# EasyEDA Pro project drive.epro, schematic Schematic1
Board Name: Board1; Create Date: 2024-12-01; Page Name: P1; Project Name: 2025完全模型组硬件_Bone; Schematic Name: Schematic1; Update Date: 2024-12-14; Company: 嘉立创EDA; Page Size: A1; Version: V1.0
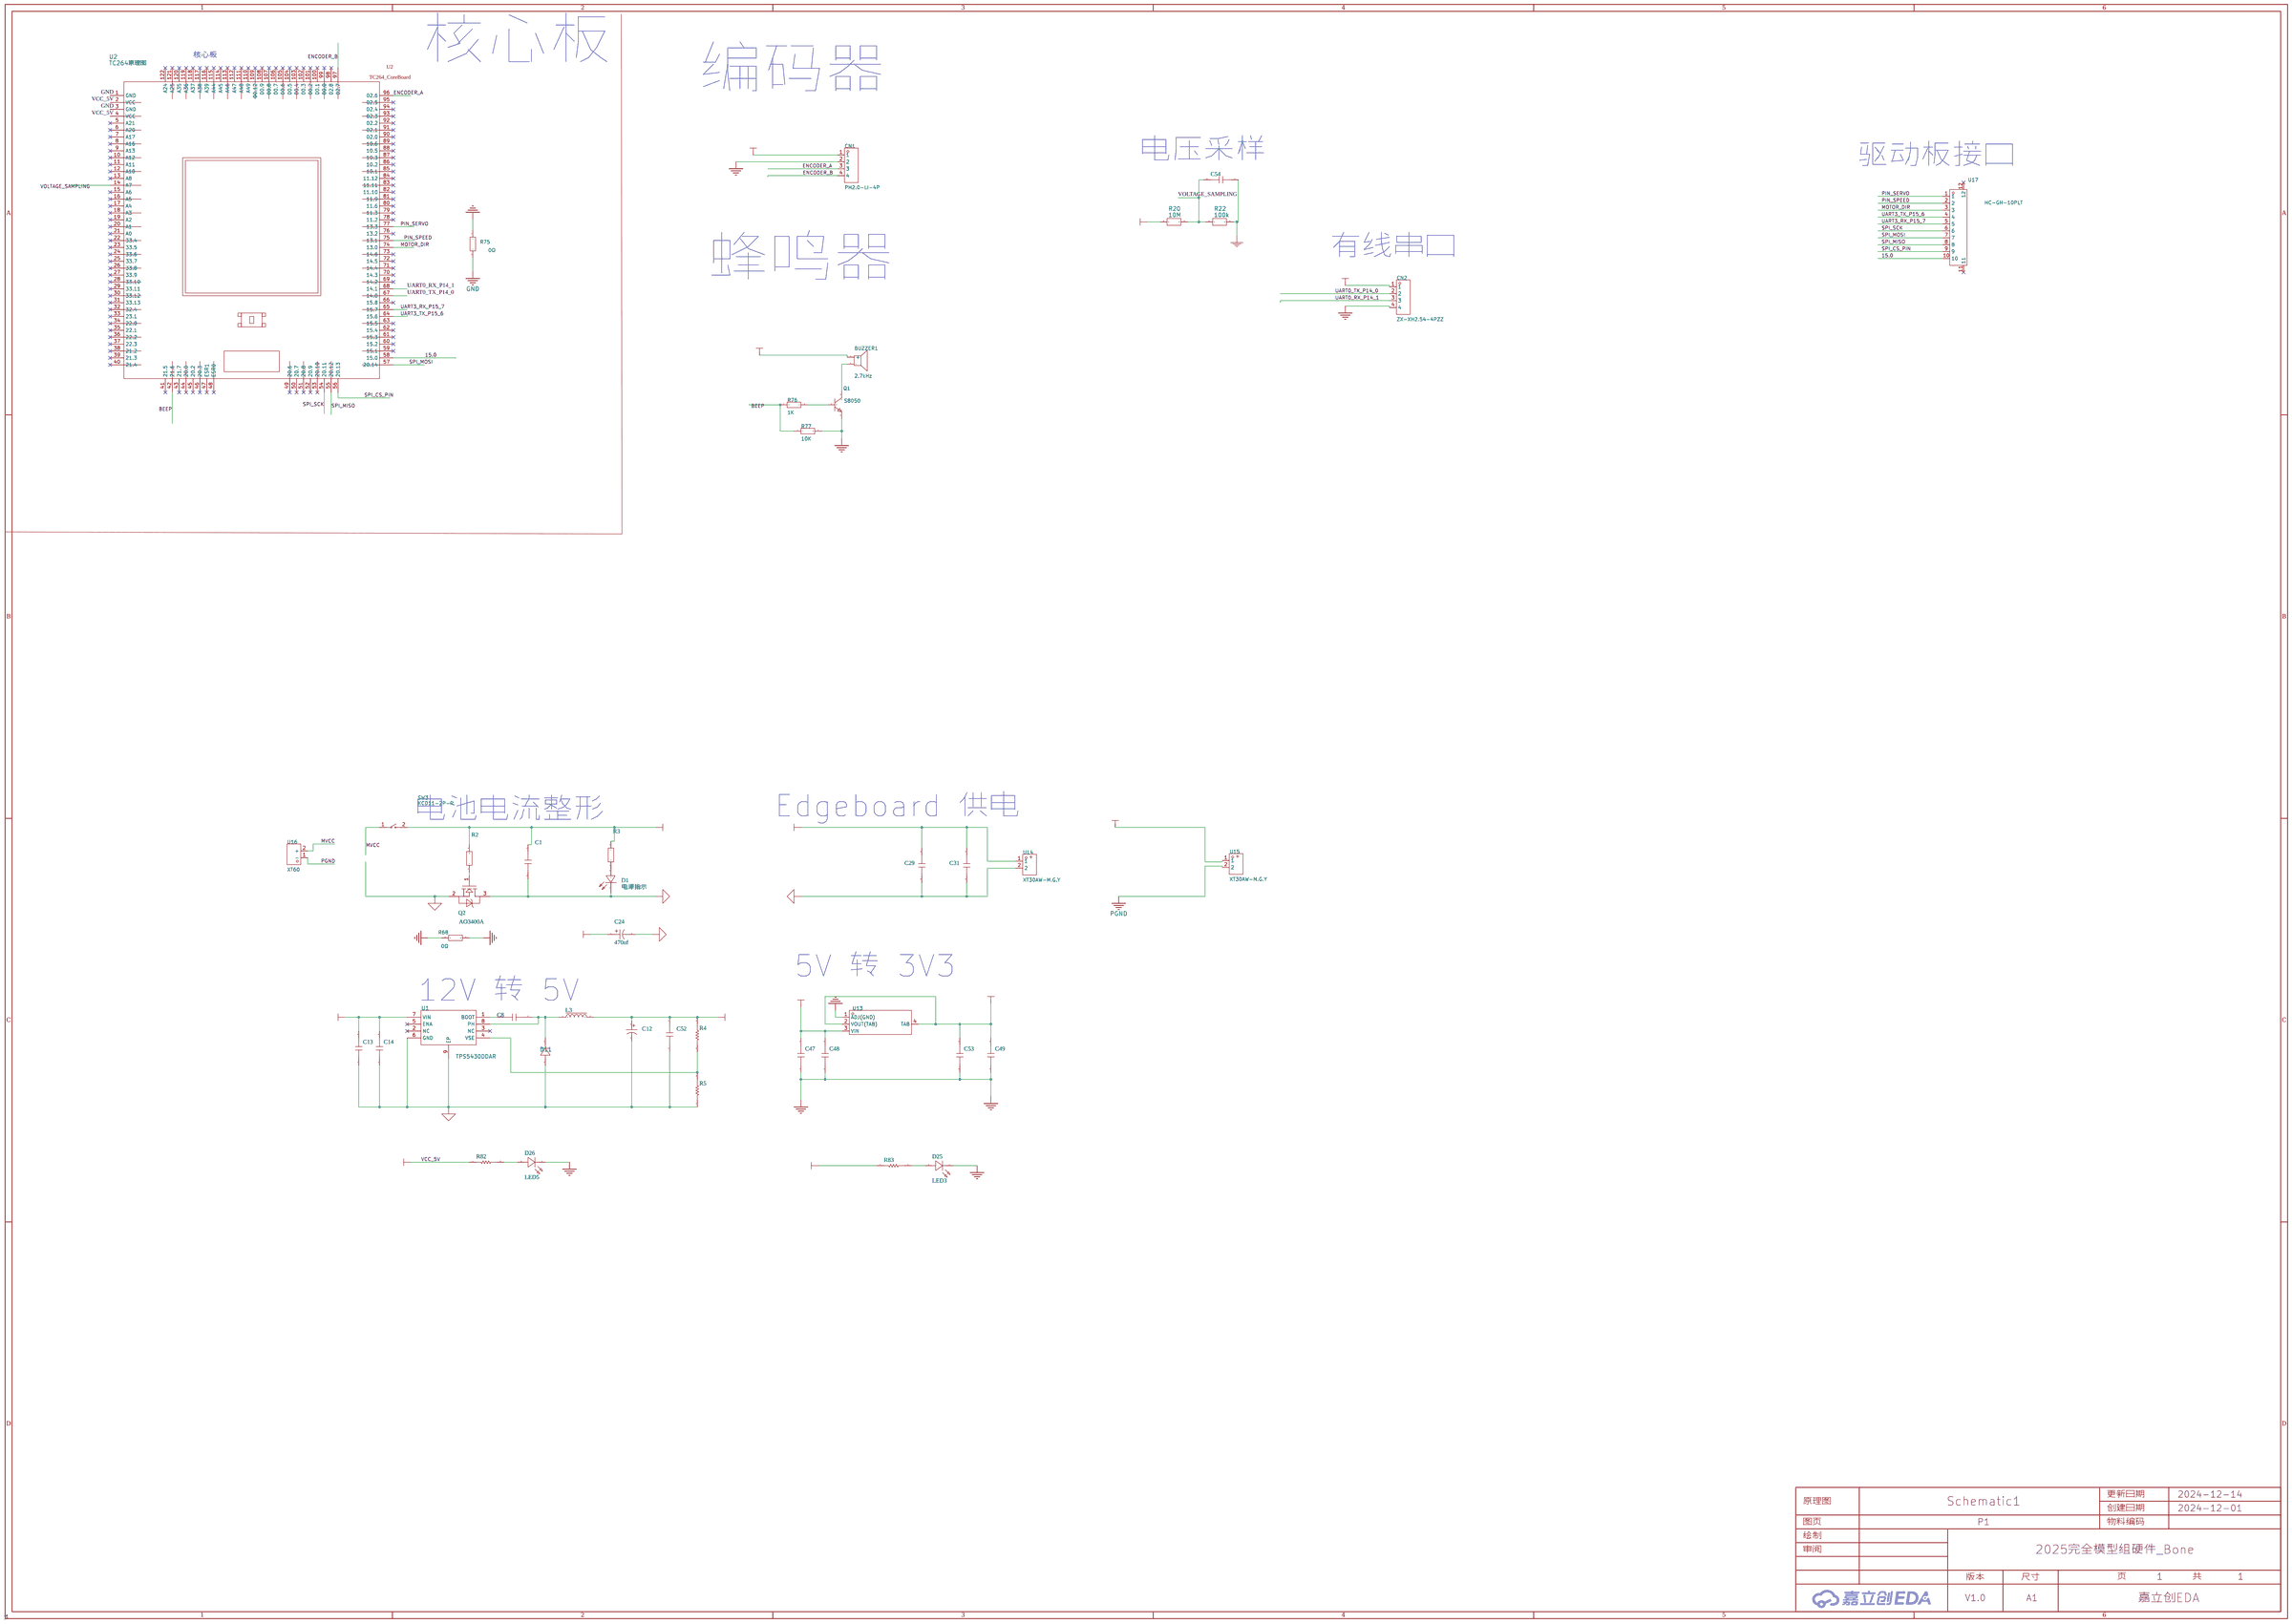
[diagram p0: schematic sheet]

## Parts
BUZZER1  2.7kHz  [BUZ-TH_BD12.0-P7.60-D0.6-FD]
C1  10uF  [C0603]
C8  100nF  [C0603]
C12  220uF  [CAP-TH_BD8.0-P3.50-D0.6-FD]
C13  10uF  [C0603]
C14  10uF  [C0603]
C24  470uF  [470uF]
C29  10uF  [C0603]
C31  10uF  [C0603]
C47  10uF  [C0603]
C48  100nF  [C0603]
C49  100nF  [C0603]
C52  100nF  [C0603]
C53  10uF  [C0603]
C54  100nF  [C0603]
CN1  PH2.0-LI-4P  [CONN-TH_4P-P2.00_HX20007-4A]
CN2  ZX-XH2.54-4PZZ  [CONN-TH_4P-P2.50_4PIN]
D1  电源指示  [LED0603-R-RD]
D11  SS34  [SMA_L4.3-W2.6-LS5.2-RD]
D25  LED3  [LED0603-R-RD_RED]
D26  LED5  [LED0603-R-RD_RED]
L3  15uH  [IND-SMD_L7.2-W6.6_GPSR07X0]
Q1  S8050  [SOT-23-3_L2.9-W1.3-P1.90-LS2.3-BR]
Q2  AO3400A  [SOT-23-3]
R2  10kΩ  [R0603]
R3  10kΩ  [R0603]
R4  10kΩ  [R0603]
R5  3.24kΩ  [R0603]
R20  10M  [R0603]
R22  100k  [R0603]
R68  0Ω  [R0603]
R75  0Ω  [R0603]
R76  1K  [R0603]
R77  10K  [R0603]
R82  10kΩ  [R0603]
R83  10kΩ  [R0603]
SW3  KCD11-2P-R  [SW-TH_2P-L15.0-W10.5-P5.00_KCD11-2P-R]
U1  TPS5430DDAR  [SOIC-8_L5.0-W4.0-P1.27-LS6.0-BL-EP2.0]
U2  TC264原理图  [TC264PCB封装]
U13  AMS1117-3.3  [SOT-223-4_L6.5-W3.5-P2.30-LS7.0-BR]
U14  XT30AW-M.G.Y  [CONN-TH_XT30AW-M.G.Y]
U15  XT30AW-M.G.Y  [CONN-TH_XT30AW-M.G.Y]
U16  XT60  [CONN-TH_XT60]
U17  HC-GH-10PLT  [CONN-SMD_10P-P1.25_HCTL_HC-GH-10PLT]

## Library data of the parts
BUZZER1 = TMB12A05_C96093: 驱动方式:有源(内含驱动线路);构造类型:电磁式;频率:2.7kHz;声压(SPL):85dB;; LCSC Part Name: TMB12A05; Supplier Part: C96093; Manufacturer: 华能; Manufacturer Part: TMB12A05; Supplier Footprint: 插件,D=12mm; Datasheet: https://atta.szlcsc.com/upload/public/pdf/source/20230426/A4FC10532558AA232D532AB83455FBA4.pdf; Supplier: LCSC; Oscillator Circuit: 有源(内含驱动线路); Technology Type: 电磁式; Operating Voltage: 4V~8V; Sound Pressure Level (SPL): 85dB; Diameter (φD): 12mm; Height: 9.8mm
C1 C29 C31 = CL21A106KAYNNNE_C15850: 容值:10uF;精度:±10%;额定电压:25V;材质(温度系数):X5R;; LCSC Part Name: 10uF ±10% 25V; Supplier Part: C15850; Manufacturer: SAMSUNG(三星); Manufacturer Part: CL21A106KAYNNNE; Supplier Footprint: 0805; JLCPCB Part Class: Basic Part; Datasheet: https://atta.szlcsc.com/upload/public/pdf/source/20160103/1457707679302.pdf; Supplier: LCSC; Tolerance: ±10%; Voltage Rated: 25V; Temperature Coefficient: X5R; Design Item ID: C_1206; Library Name: Schlib_AISmartCar
C8 C52 C54 = 0603B104K500NT: 容值:100nF;精度:±10%;额定电压:50V;材质(温度系数):X7R;; LCSC Part Name: 100nF ±10% 50V; Supplier Part: C30926; Manufacturer: FH(风华); Supplier Footprint: 0603; JLCPCB Part Class: Extended Part; Datasheet: https://atta.szlcsc.com/upload/public/pdf/source/20170923/C30926_1506149436298988724.pdf; Supplier: LCSC; Tolerance: ±10%; Voltage Rated: 50V; Temperature Coefficient: X7R; Design Item ID: C_0603; Library Name: Schlib_AISmartCar
C12 = KM227M035F12RR0VH2FP0: 容值:220uF;精度:±20%;额定电压:35V;纹波电流:-;等效串联电阻:-;; LCSC Part Name: 220uF ±20% 35V; Supplier Part: C2063; Manufacturer: CX(承兴); Supplier Footprint: 插件,D8xL12mm; JLCPCB Part Class: Extended Part; Datasheet: https://atta.szlcsc.com/upload/public/pdf/source/20211027/06D6BA3719C264B639DC286D935D03EA.pdf; Supplier: LCSC; Tolerance: ±20%; Rated Voltage: 35V; φD: 8mm; L: 12mm; Lead Spacing: 3.5mm; Lifetime @ Temp: 2000hrs@105℃; Voltage Rated: 50V; Temperature Coefficient: X7R; Design Item ID: C_0603; Library Name: Schlib_AISmartCar
C13 C14 C47 C53 = CL21A106KAYNNNE_C15850: 容值:10uF;精度:±10%;额定电压:25V;温度系数:X5R;; LCSC Part Name: 10uF ±10% 25V; Supplier Part: C15850; Manufacturer: SAMSUNG(三星); Manufacturer Part: CL21A106KAYNNNE; Supplier Footprint: 0805; JLCPCB Part Class: Basic Part; Datasheet: https://atta.szlcsc.com/upload/public/pdf/source/20160103/1457707679302.pdf; Supplier: LCSC; Tolerance: ±10%; Voltage Rated: 25V; Temperature Coefficient: X5R; Design Item ID: C_0805; Library Name: Schlib_AISmartCar
C24 = XT470UF16V90RV0085: 容值:470uF;额定电压:16V;纹波电流:-;等效串联电阻:-;; LCSC Part Name: 470uF 16V; Supplier Part: C2992615; Manufacturer: KNSCHA(科尼盛); Supplier Footprint: SMD,D8xL10.5mm; JLCPCB Part Class: Extended Part; Datasheet: https://atta.szlcsc.com/upload/public/pdf/source/20220628/F17511B0DF840900412A2C849AFA4596.pdf; Supplier: LCSC; Rated Voltage: 16V; Design Item ID: C_10x10.2_SMD; Library Name: Schlib_AISmartCar
C48 C49 = 0603B104K500NT: 容值:100nF;精度:±10%;额定电压:50V;材质(温度系数):X7R;; LCSC Part Name: 100nF ±10% 50V; Supplier Part: C30926; Manufacturer: FH(风华); Supplier Footprint: 0603; JLCPCB Part Class: Extended Part; Datasheet: https://atta.szlcsc.com/upload/public/pdf/source/20170923/C30926_1506149436298988724.pdf; Supplier: LCSC; Tolerance: ±10%; Voltage Rated: 50V; Temperature Coefficient: X7R; Design Item ID: C_0805; Library Name: Schlib_AISmartCar
CN1 = PH2.0-LI-4P: Supplier Part: C9900014055; JLCPCB Part Class: 扩展库; Supplier: LCSC
CN2 = ZX-XH2.54-4PZZ: 插针结构:1x4P;间距:2.54mm;安装方式:直插;参考系列:XH;总PIN数:4P;排数:1;每排PIN数:4;行距:-;额定电流:3A;触头材质:黄铜;触头镀层:锡;工作温度范围:-25℃~+85℃;; Supplier Part: C7429634; Manufacturer: Megastar(兆星); Supplier Footprint: 插件,P=2.5mm; Datasheet: https://atta.szlcsc.com/upload/public/pdf/source/20230619/B529A2163E0159A644AB3383D208FB03.pdf; Supplier: LCSC; Pins Structure: 1x4P; Pitch: 2.54mm; Mounting Style: 直插; Reference Series: XH; Number of Pins: 4P; Number of Rows: 1; Number of PINs Per Row: 4; Current Rating (Max): 3A; Contact Material: 黄铜; Contact Plating: 锡; Operating Temperature Range: -25℃~+85℃
D1 = KT-0603R: 发光颜色:红色;工作温度:-40℃~+85℃;; LCSC Part Name: 红灯 0603 (90~100mcd); Supplier Part: C2286; Manufacturer: KENTO; Supplier Footprint: 0603; JLCPCB Part Class: Basic Part; Datasheet: https://atta.szlcsc.com/upload/public/pdf/source/20160616/1466072038404.pdf; Supplier: LCSC; Emitted Color: 红色; Operating Temperature: -40℃~+85℃; Design Item ID: LED_0603; Library Name: Schlib_AISmartCar
D11 = SS34_C8678: 二极管配置:独立式;直流反向耐压(Vr):40V;平均整流电流(Io):3A;正向压降(Vf):550mV@3A;; LCSC Part Name: 40V 3A 550mV@3A; Supplier Part: C8678; Manufacturer: MDD; Supplier Footprint: SMA(DO-214AC); JLCPCB Part Class: Basic Part; Datasheet: https://atta.szlcsc.com/upload/public/pdf/source/20230314/A80AE34493C69B89E2F4B1712F433538.pdf; Supplier: LCSC; Diode Configuration: 独立式; Reverse Voltage (Vr): 40V; Average Rectified Current (Io): 3A; Forward Voltage (Vf@If): 550mV@3A; Reverse Leakage Current (Ir): 500uA@40V; Power Dissipation: 400mW; Reverse Leakage Current: 1uA@75V; Reverse Recovery Time (trr): 8ns; Operating Temperature: -55℃~+150℃@(Tj); Check: true
D25 D26 = NCD0603R3: 尺寸1.6x0.8x0.8；IF=20ma：1.6~2.6v，620~640nm,51~150mcd金线，光强高，功耗低，可靠性好，寿命长; LCSC Part Name: 红色;贴片LED;0603红灯;; Supplier Part: C3151730; Manufacturer: 国星光电; Supplier Footprint: 0603; JLCPCB Part Class: Extended Part; Datasheet: https://atta.szlcsc.com/upload/public/pdf/source/20220704/CBFF28C1847A97213A75929E60B7DDE7.pdf; Supplier: LCSC; Emitted Color: 翠绿; Lens Color: 无色透明; Dominant Wavelength: 520nm~535nm; Peak Wavelength: 518nm; Forward Current: 20mA; Power Dissipation: 110mW; Viewing Angle: 120°; Operating Temperature: -40℃~+85℃; Design Item ID: LED_0603; Library Name: Schlib_IntelligentCar
L3 = CYA0630-15UH: 电感值:15uH;精度:±20%;额定电流:3A;直流电阻(DCR):98mΩ;; LCSC Part Name: 15uH ±20% 98mΩ; Supplier Part: C5189959; Manufacturer: SHOU HAN(首韩); Supplier Footprint: SMD,6.6x7.2mm; JLCPCB Part Class: Extended Part; Datasheet: https://atta.szlcsc.com/upload/public/pdf/source/20221010/DA5ED07F016B1136355C6E3EFCD4CFD8.pdf; Supplier: LCSC; Tolerance: ±20%; Rated Current: 3A; DC Resistance (DCR): 98mΩ; Width: 6mm; Height: 3mm; Length: 6.4mm; Design Item ID: L_7*7*4; Library Name: Schlib_AISmartCar
Q1 = S8050_C20069125: 晶体管类型:NPN;集电极电流(Ic):500mA;集射极击穿电压(Vceo):25V;功率(Pd):300mW;直流电流增益(hFE@Ic,Vce):120@50mA,1.0V;; LCSC Part Name: NPN 电流:500mA 耐压:25V; Supplier Part: C20069125; Manufacturer: 宏迦橙; Supplier Footprint: SOT-23; Datasheet: https://atta.szlcsc.com/upload/public/pdf/source/20240403/2D78449C96B6E27F13BF8BDF79E27159.pdf; Supplier: LCSC; Transistor Type: NPN; Collector Current (Ic): 500mA; Collector-Emitter Breakdown Voltage (Vceo): 25V; Power Dissipation (Pd): 300mW; DC Current Gain (hFE@Ic,Vce): 120@50mA,1.0V; Transition Frequency (fT): 100MHz; Collector Cut-Off Current (Icbo): 100nA; Collector-Emitter Saturation Voltage (VCE(sat)@Ic,Ib): 600mV@500mA,50mA; Operating Temperature: -55℃~+150℃
Q2 = AO3400A: N-MOS; Design Item ID: AO3400; Library Name: Schlib_AISmartCar; Check: false
R2-R4 R82 R83 = 0603WAF1002T5E: 电阻类型:厚膜电阻;阻值:10kΩ;精度:±1%;功率:100mW;; LCSC Part Name: 厚膜电阻 10kΩ ±1% 100mW; Supplier Part: C25804; Manufacturer: UNI-ROYAL(厚声); Supplier Footprint: 0603; JLCPCB Part Class: Basic Part; Datasheet: https://atta.szlcsc.com/upload/public/pdf/source/20200306/C422600_1E6D84923E4A46A82E41ADD87F860B5C.pdf; Supplier: LCSC; Type: 厚膜电阻; Tolerance: ±1%; Power(Watts): 100mW; Temperature Coefficient: ±100ppm/℃; Overload Voltage (Max): 75V; Operating Temperature Range: -55℃~+155℃; Design Item ID: R_0603; Library Name: Schlib_AISmartCar
R5 = 0603WAF3241T5E: 电阻类型:厚膜电阻;阻值:3.24kΩ;精度:±1%;功率:100mW;; LCSC Part Name: 3.24kΩ ±1% 100mW; Supplier Part: C22994; Manufacturer: UNI-ROYAL(厚声); Supplier Footprint: 0603; JLCPCB Part Class: Extended Part; Datasheet: https://atta.szlcsc.com/upload/public/pdf/source/20200306/C422600_1E6D84923E4A46A82E41ADD87F860B5C.pdf; Supplier: LCSC; Type: 厚膜电阻; Tolerance: ±1%; Power(Watts): 100mW; Temperature Coefficient: ±100ppm/℃; Overload Voltage (Max): 75V; Operating Temperature Range: -55℃~+155℃; Design Item ID: R_0603; Library Name: Schlib_AISmartCar
R20 = 510k
R22 = 100k
R68 R75 = 0603WAF0000T5E: 电阻类型:厚膜电阻;阻值:0Ω;精度:±1%;功率:100mW;最大工作电压:75V;工作温度范围:-55℃~+155℃;; LCSC Part Name: 0Ω ±1% 100mW; Supplier Part: C21189; Manufacturer: UNI-ROYAL(厚声); Supplier Footprint: 0603; JLCPCB Part Class: Basic Part; Datasheet: https://atta.szlcsc.com/upload/public/pdf/source/20200306/C422600_1E6D84923E4A46A82E41ADD87F860B5C.pdf; Supplier: LCSC; Type: 厚膜电阻; Tolerance: ±1%; Power(Watts): 100mW; Overload Voltage (Max): 75V; Operating Temperature Range: -55℃~+155℃
R76 R77 = Res_0603: Supplier Footprint: 0603
SW3 = KCD11-2P-R: 带灯:无;引脚样式:焊片;额定电流:3A;额定电压(AC):250V;额定电压(DC):-;电路结构:单刀单掷;机械寿命:1万次;; LCSC Part Name: 10.5*15mm 两脚两档跷板开关 红钮; Supplier Part: C5884414; Manufacturer: SHOU HAN(首韩); Supplier Footprint: 插件; JLCPCB Part Class: Extended Part; Datasheet: https://atta.szlcsc.com/upload/public/pdf/source/20230506/CD06DFDE35C8048D34175BFF4AF6A2C2.pdf; Supplier: LCSC; Switch Length: 15mm; Switch Width: 10.5mm; Switch Height: 17.2mm; Actuator Type: 凹面弯曲; With Lamp: 无; Pin Style: 焊片; Actuator Color: 红色; Contact Current: 3A; Voltage Rating (AC): 250V; Circuit: 单刀单掷; Mechanical Life: 1万次; Operating Temperature: 0℃~+125℃; Actuator Identifier: - O
U1 = TPS5430DDAR: 可输出电流:3A;开关工作频率:500kHz;输出类型:Adjustable;输出电压的路数:1;功能类型:Step-Down;输出配置:Positive;; Supplier Part: C9864; Manufacturer: TI(德州仪器); Supplier Footprint: SOP-8_EP_150mil; JLCPCB Part Class: Basic Part; Datasheet: https://atta.szlcsc.com/upload/public/pdf/source/20161207/1481104217724.pdf; Supplier: LCSC; Library Name: Schlib_AISmartCar
U2 = TC264原理图
U13 = AMS1117-3.3_C347222: 输出类型:固定;最大输入电压:18V;输出电压:3.3V;输出电流:1A;电源纹波抑制比(PSRR):60dB@(120Hz);输出极性:正;; LCSC Part Name: 输入18V 输出3.3V 1A; Supplier Part: C347222; Manufacturer: UMW(友台半导体); Supplier Footprint: SOT-223; JLCPCB Part Class: Extended Part; Datasheet: https://atta.szlcsc.com/upload/public/pdf/source/20231109/155D79A26D9DB04352555A58D5969DC8.pdf; Supplier: LCSC; Output Type: 固定; Maximum Input Voltage: 18V; Output Voltage: 3.3V; Output Current: 1A; Power Supply Rejection Ratio (PSRR): 60dB@(120Hz); Dropout Voltage: 1.3V@(1A); Output Polarity: 正; Number of Outputs: 1; Quiescent Current (Ground Current): 12mA; Operating Temperature: 0℃~+125℃
U14 U15 = XT30AW-M.G.Y: LCSC Part Name: XT30AW防水锁扣镀金15A二芯公插头; Supplier Part: C19268026; Manufacturer: AMASS(艾迈斯); JLCPCB Part Class: 扩展库; Datasheet: https://atta.szlcsc.com/upload/public/pdf/source/20231221/C234D60309612BC9E76FC24FD9732617.pdf; Supplier: LCSC
U16 = XT60: 类别:-;类型1:-;; LCSC Part Name: AMASS(艾迈斯) XT60模型插头 3.5mm镀金香蕉头公头（电调端）XT60-M; Supplier Part: C98733; Manufacturer: AMASS(艾迈斯); JLCPCB Part Class: 扩展库; Datasheet: https://atta.szlcsc.com/upload/public/pdf/source/20170606/1496716524919.pdf; Supplier: LCSC; Brand: 艾迈斯; Type: 香蕉头; Colour: 黄色; InterfaceType: 公头; specifications: 3.5mm
U17 = HC-GH-10PLT_C3011961: 插针结构:1x10P;间距:1.25mm;安装方式:立贴;参考系列:GH;总PIN数:10P;排数:1;每排PIN数:10;行距:-;额定电流:1A;触头材质:磷铜;触头镀层:锡;工作温度范围:-25℃~+85℃;; LCSC Part Name: 1x10P 间距:1.25mm 立贴 系列:GH; Supplier Part: C3011961; Manufacturer: HCTL(华灿天禄); Supplier Footprint: SMD,P=1.25mm; Datasheet: https://atta.szlcsc.com/upload/public/pdf/source/20210728/C2845406_3EB3A7BF0D8EC31310CEF8E2A2CF0B88.pdf; Supplier: LCSC; Pins Structure: 1x10P; Pitch: 1.25mm; Mounting Style: 立贴; Reference Series: GH; Number of Pins: 10P; Number of Rows: 1; Number of PINs Per Row: 10; Current Rating (Max): 1A; Contact Material: 磷铜; Contact Plating: 锡; Operating Temperature Range: -25℃~+85℃; Rated Voltage (Max): 50V; Plastic Material: LCP; Supplementary Features: 辅助焊脚

## Nets
DGND: CN1.2 CN2.4 Q1.2(E) R68.2 R75.1 R77.2
GND: R75.2 U2.1(GND) U2.3(GND)
PGND: C1.2 C12.2 C13.1 C14.1 C24.2 C29.2 C31.2 C47.1 C48.1 C49.1 C52.1 C53.1 C54.1 D1.1(K) D11.2(A) D25.1(K) D26.1(K) Q2.2(S) Q2.3(D) R5.1 R22.1 R68.1 U1.6(GND) U1.9(EP) U13.1(ADJ(GND)) U14.2 U15.2 U16.1(-)
VCC_3V: C49.2 C53.2 R83.1 U13.2(VOUT(TAB)) U13.4(TAB)
VCC_5V: BUZZER1.1(+) C12.1 C47.2 C48.2 C52.2 CN1.1 CN2.1 L3.2 R4.2 R82.1 U2.2(VCC) U2.4(VCC) U13.3(VIN)
VCC_12V: C1.1 C13.2 C14.2 C24.1 C29.1 C31.1 R2.2 R3.2 R20.2 SW3.2 U1.7(VIN) U14.1 U15.1
15.0: U2.58(15.0) U17.10
BEEP: R76.1 R77.1 U2.42(21.6)
ENCODER_A: CN1.3 U2.96(02.6)
ENCODER_B: CN1.4 U2.97(02.7)
MOTOR_DIR: U2.74(13.0) U17.3
MVCC: SW3.1 U16.2(+)
PIN_SERVO: U2.77(13.3) U17.1
PIN_SPEED: U2.75(13.1) U17.2
SPI_CS_PIN: U2.56(20.13) U17.9
SPI_MISO: U2.55(20.12) U17.8
SPI_MOSI: U2.57(20.14) U17.7
SPI_SCK: U2.54(20.11) U17.6
UART0_RX_P14_1: CN2.3 U2.68(14.1)
UART0_TX_P14_0: CN2.2 U2.67(14.0)
UART3_RX_P15_7: U2.65(15.7) U17.5
UART3_TX_P15_6: U2.64(15.6) U17.4
VOLTAGE_SAMPLING: C54.2 R20.1 R22.2 U2.14(A7)
$1N2415: BUZZER1.2 Q1.3(C)
$1N2515: Q1.1(B) R76.2
$1N4319: C8.2 D11.1(C) L3.1 U1.8(PH)
$1N4320: R4.1 R5.2 U1.4(VSE)
$1N4323: C8.1 U1.1(BOOT)
$1N12038: Q2.1(G) R2.1
Net-(D1-2): D1.2(A) R3.1
Net-(D25-2): D25.2(A) R83.2
Net-(D26-2): D26.2(A) R82.2

Not connected (* = marked no-connect by the designer): U1 2(NC)* 3(NC)* 5(ENA)*; U2 5(A21)* 6(A20)* 7(A17)* 8(A16)* 9(A13)* 10(A12)* 11(A11)* 12(A10)* 13(A8)* 15(A6)* 16(A5)* 17(A4)* 18(A3)* 19(A2)* 20(A1)* 21(A0)* 22(33.4)* 23(33.5)* 24(33.6)* 25(33.7)* 26(33.8)* 27(33.9)* 28(33.10)* 29(33.11)* 30(33.12)* 31(33.13)* 32(32.4)* 33(23.1)* 34(22.0)* 35(22.1)* 36(22.2)* 37(22.3)* 38(21.2)* 39(21.3)* 40(21.4)* 41(21.5)* 43(21.7)* 44(20.0)* 45(20.2)* 46(20.3)* 47(ESR1)* 48(ESR0)* 49(20.6)* 50(20.7)* 51(20.8)* 52(20.9)* 53(20.10)* 59(15.1)* 60(15.2)* 61(15.3)* 62(15.4)* 63(15.5)* 66(15.8)* 69(14.2)* 70(14.3)* 71(14.4)* 72(14.5)* 73(14.6)* 76(13.2)* 78(11.2)* 79(11.3)* 80(11.6)* 81(11.9)* 82(11.10)* 83(11.11)* 84(11.12)* 85(10.1)* 86(10.2)* 87(10.3)* 88(10.5)* 89(10.6)* 90(02.0)* 91(02.1)* 92(02.2)* 93(02.3)* 94(02.4)* 95(02.5)* 98(02.8)* 99(00.0)* 100(00.1)* 101(00.2)* 102(00.3)* 103(00.4)* 104(00.5)* 105(00.6)* 106(00.7)* 107(00.8)* 108(00.9)* 109(00.12)* 110(A49)* 111(A48)* 112(A47)* 113(A46)* 114(A45)* 115(A44)* 116(A39)* 117(A38)* 118(A37)* 119(A36)* 120(A35)* 121(A25)* 122(A24)*; U17 11* 12*

## Notes on the sheet
- 核心板
- 编码器
- 核心板
- 电压采样
- 驱动板接口
- 蜂鸣器
- 有线串口
- 电池电流整形
- Edgeboard 供电
- 5V 转 3V3
- 12V 转 5V
